# EAGLE design Input Board (EAGLE 6.5.0)
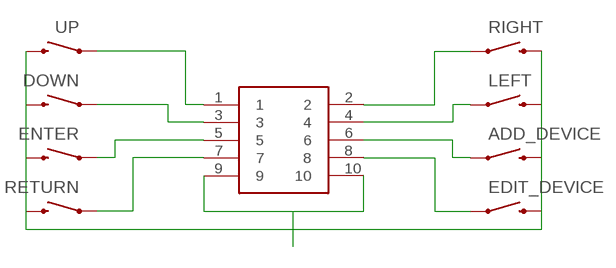
[diagram p0: schematic, sheet 1]

## Parts
ADD_DEVICE  SWITCH-MOMENTARY-212MM  [TACTILE-PTH-12MM]
DOWN  SWITCH-MOMENTARY-212MM  [TACTILE-PTH-12MM]
EDIT_DEVICE  SWITCH-MOMENTARY-212MM  [TACTILE-PTH-12MM]
ENTER  SWITCH-MOMENTARY-212MM  [TACTILE-PTH-12MM]
LEFT  SWITCH-MOMENTARY-212MM  [TACTILE-PTH-12MM]
RETURN  SWITCH-MOMENTARY-212MM  [TACTILE-PTH-12MM]
RIGHT  SWITCH-MOMENTARY-212MM  [TACTILE-PTH-12MM]
U$1  10PIN_HEADER_MALE_SMD  [2X5-SHROUDED_SMD_BOTTOM]
UP  SWITCH-MOMENTARY-212MM  [TACTILE-PTH-12MM]

## Nets
N$1: U$1.1 UP.1
N$2: DOWN.1 U$1.3
N$3: ENTER.1 U$1.5
N$4: RETURN.1 U$1.7
N$5: RIGHT.1 U$1.2
N$6: LEFT.1 U$1.4
N$7: ADD_DEVICE.1 U$1.6
N$8: EDIT_DEVICE.1 U$1.8
N$10: ADD_DEVICE.3 DOWN.3 EDIT_DEVICE.3 ENTER.3 LEFT.3 RETURN.3 RIGHT.3 U$1.9 U$1.10 UP.3

## Library data of the parts
ADD_DEVICE DOWN EDIT_DEVICE ENTER LEFT RETURN RIGHT UP = SparkFun-Electromechanical:SWITCH-MOMENTARY-2: Various NO switches- pushbuttons, reed, etc
U$1 = NU STEM:10PIN_HEADER_MALE_SMD

## Board
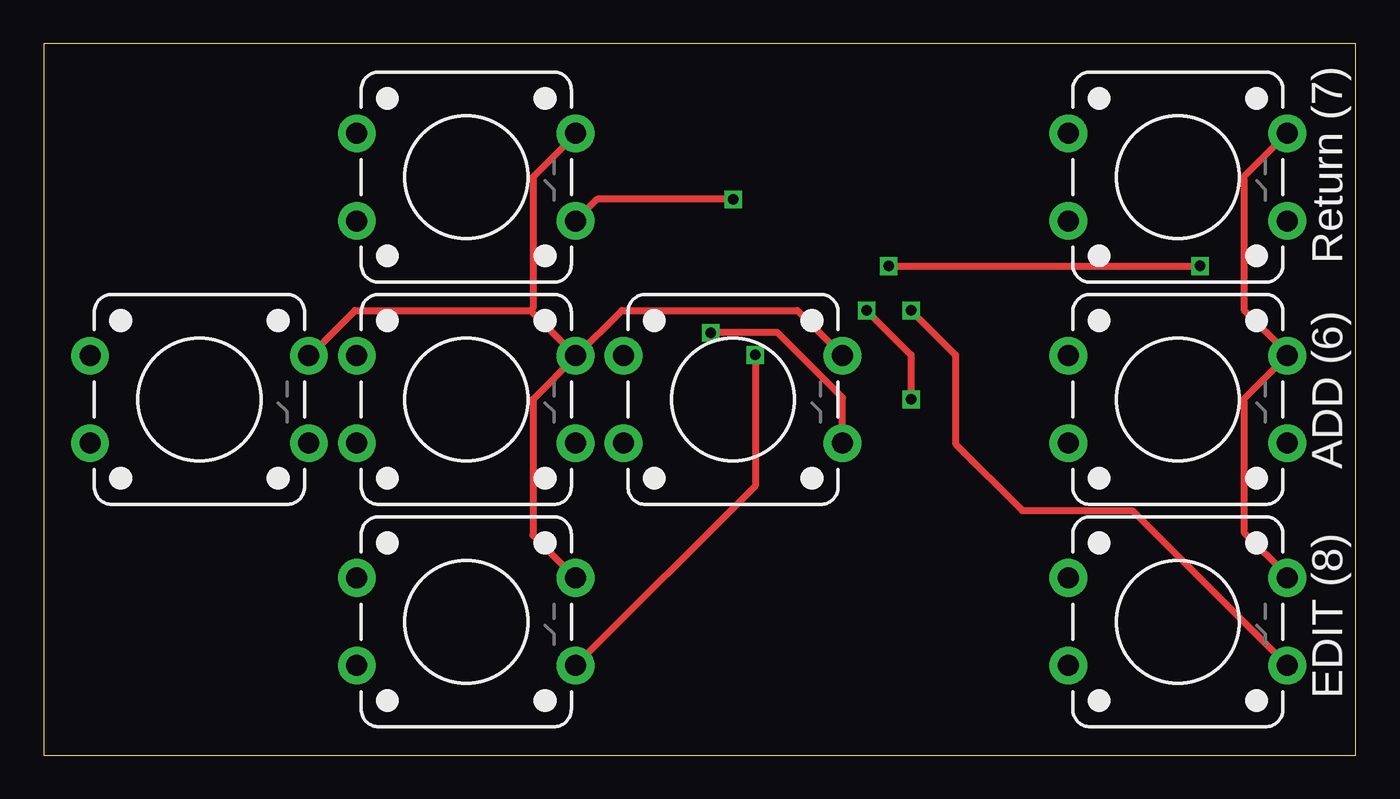
[diagram p1: board, top side]
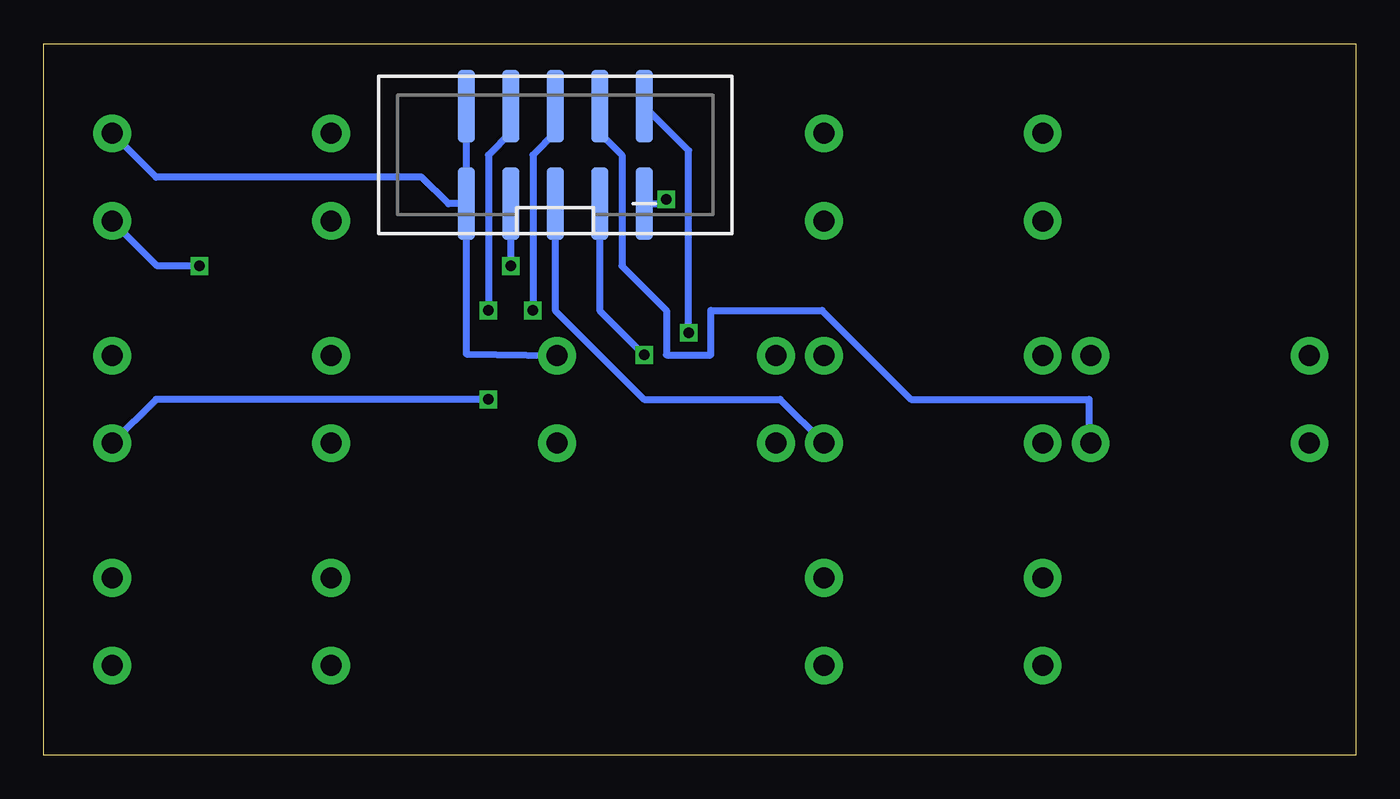
[diagram p2: board, bottom side, seen from below]

Size 74.93 x 40.64 mm. Coordinates in mm from the lower left corner, seen from the top.
Outline: 0,0 74.93,0 74.93,40.64 0,40.64 0,0
Copper layers (1*16): Top 0.035mm / dielectric 1.5mm / Bottom 0.035mm
Design rules "default": minimum track width 10mil, minimum drill 24mil, track to track 8mil, track to pad 8mil, pad to pad 8mil, via to via 8mil, smd to smd 8mil, copper to edge 40mil, drill to drill 8mil, minimum pad ring 10mil, minimum via ring 8mil, stop-mask expansion 4mil, vias tented up to drill 0mil, thermal gap 10mil

### Footprints (pad centres in the part's own frame; a part is rotated, then mirrored left to right if it is on the bottom)
TACTILE-PTH-12MM = drill 1.2 pad 2.159: 1 6.25,-2.5; 2 -6.25,-2.5; 3 6.25,2.5; 4 -6.25,2.5
2X5-SHROUDED_SMD_BOTTOM = smd 4.15 x 1 bottom: 1 -2.794,5.08; 2 2.794,5.08; 3 -2.794,2.54; 4 2.794,2.54; 5 -2.794,0; 6 2.794,0; 7 -2.794,-2.54; 8 2.794,-2.54; 9 -2.794,-5.08; 10 2.794,-5.08

### Placement (x,y rotation side)
ADD_DEVICE  64.77,20.32 0 top
DOWN  24.13,7.62 0 top
EDIT_DEVICE  64.77,7.62 0 top
ENTER  24.13,20.32 0 top
LEFT  8.89,20.32 0 top
RETURN  64.77,33.02 0 top
RIGHT  39.37,20.32 0 top
U$1  45.72,34.29 90 top
UP  24.13,33.02 0 top

### Tracks (layer width: path | path; a pad name or v marks a point on that pad's centre or on a via)
N$1  (via drill 0.6)
  Top 0.406: v39.37,31.75 31.61,31.75 UP.1
  Bottom 0.406: U$1.1 39.62,31.5 v39.37,31.75
N$2  (via drill 0.6)
  Top 0.406: v40.64,22.86 40.64,15.38 DOWN.1
  Bottom 0.406: U$1.3 43.18,25.4 v40.64,22.86
N$3
  Bottom 0.406: U$1.5 45.72,25.4 40.64,20.32 32.88,20.32 ENTER.1
N$4  (via drill 0.6)
  Top 0.406: v48.26,27.94 v66.04,27.94
  Bottom 0.406: U$1.7 v48.26,27.94 | v66.04,27.94 68.44,27.94 RETURN.1
N$5  (via drill 0.6)
  Top 0.406: RIGHT.1 45.62,20.42 41.91,24.13 v38.1,24.13
  Bottom 0.406: v38.1,24.13 38.1,34.54 U$1.2
N$6
  Bottom 0.406: U$1.4 43.18,35.56 41.91,34.29 41.91,27.94 39.37,25.4 39.37,22.86 36.83,22.86 36.83,25.4 30.48,25.4 25.4,20.32 15.24,20.32 15.24,17.92 LEFT.1
N$7  (via drill 0.6)
  Top 0.406: v46.99,25.4 49.53,22.86 v49.53,20.32
  Bottom 0.406: U$1.6 45.72,35.56 46.99,34.29 v46.99,25.4 | v49.53,20.32 68.52,20.32 ADD_DEVICE.1
N$8  (via drill 0.6)
  Top 0.406: v49.53,25.4 52.07,22.86 52.07,17.78 55.88,13.97 62.17,13.97 EDIT_DEVICE.1
  Bottom 0.406: U$1.8 48.26,35.56 49.53,34.29 v49.53,25.4
N$10
  Top 0.406: LEFT.3 15.2,22.82 17.78,25.4 27.8,25.4 | 27.8,25.4 ENTER.3 30.38,22.76 | UP.3 30.38,35.46 27.94,33.02 27.94,25.54 27.8,25.4 | 30.38,22.76 27.94,20.32 27.94,12.56 DOWN.3 | EDIT_DEVICE.3 71.02,10.26 68.58,12.7 68.58,20.38 ADD_DEVICE.3 71.02,22.96 68.58,25.4 68.58,33.08 RETURN.3 | 30.38,22.76 33.02,25.4 43.04,25.4 RIGHT.3
  Bottom 0.406: U$1.10 U$1.9 | U$1.9 50.8,22.92 RIGHT.3 | U$1.9 51.82,31.5 53.34,33.02 68.52,33.02 RETURN.3

### Text on the board
tPlace: Return (7) | ADD (6) | EDIT (8)